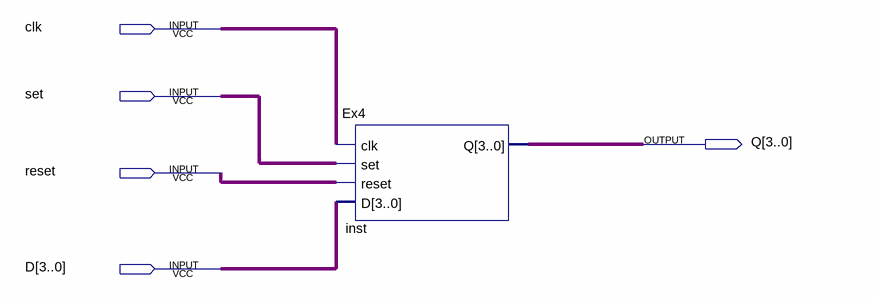
[diagram p0: schematic sheet]
// Quartus schematic Ex4_SCHEME.bdf as structural Verilog: 1 symbols, 5 pins
module Ex4_SCHEME (
  input  clk,
  input  set,
  input  reset,
  input  [3:0] D,
  output [3:0] Q
);

  Ex4 inst (.clk(clk), .set(set), .reset(reset), .D(D), .Q(Q));
endmodule
